# EasyEDA Pro project 轮足机器人主板&核心板.epro, board PCB7
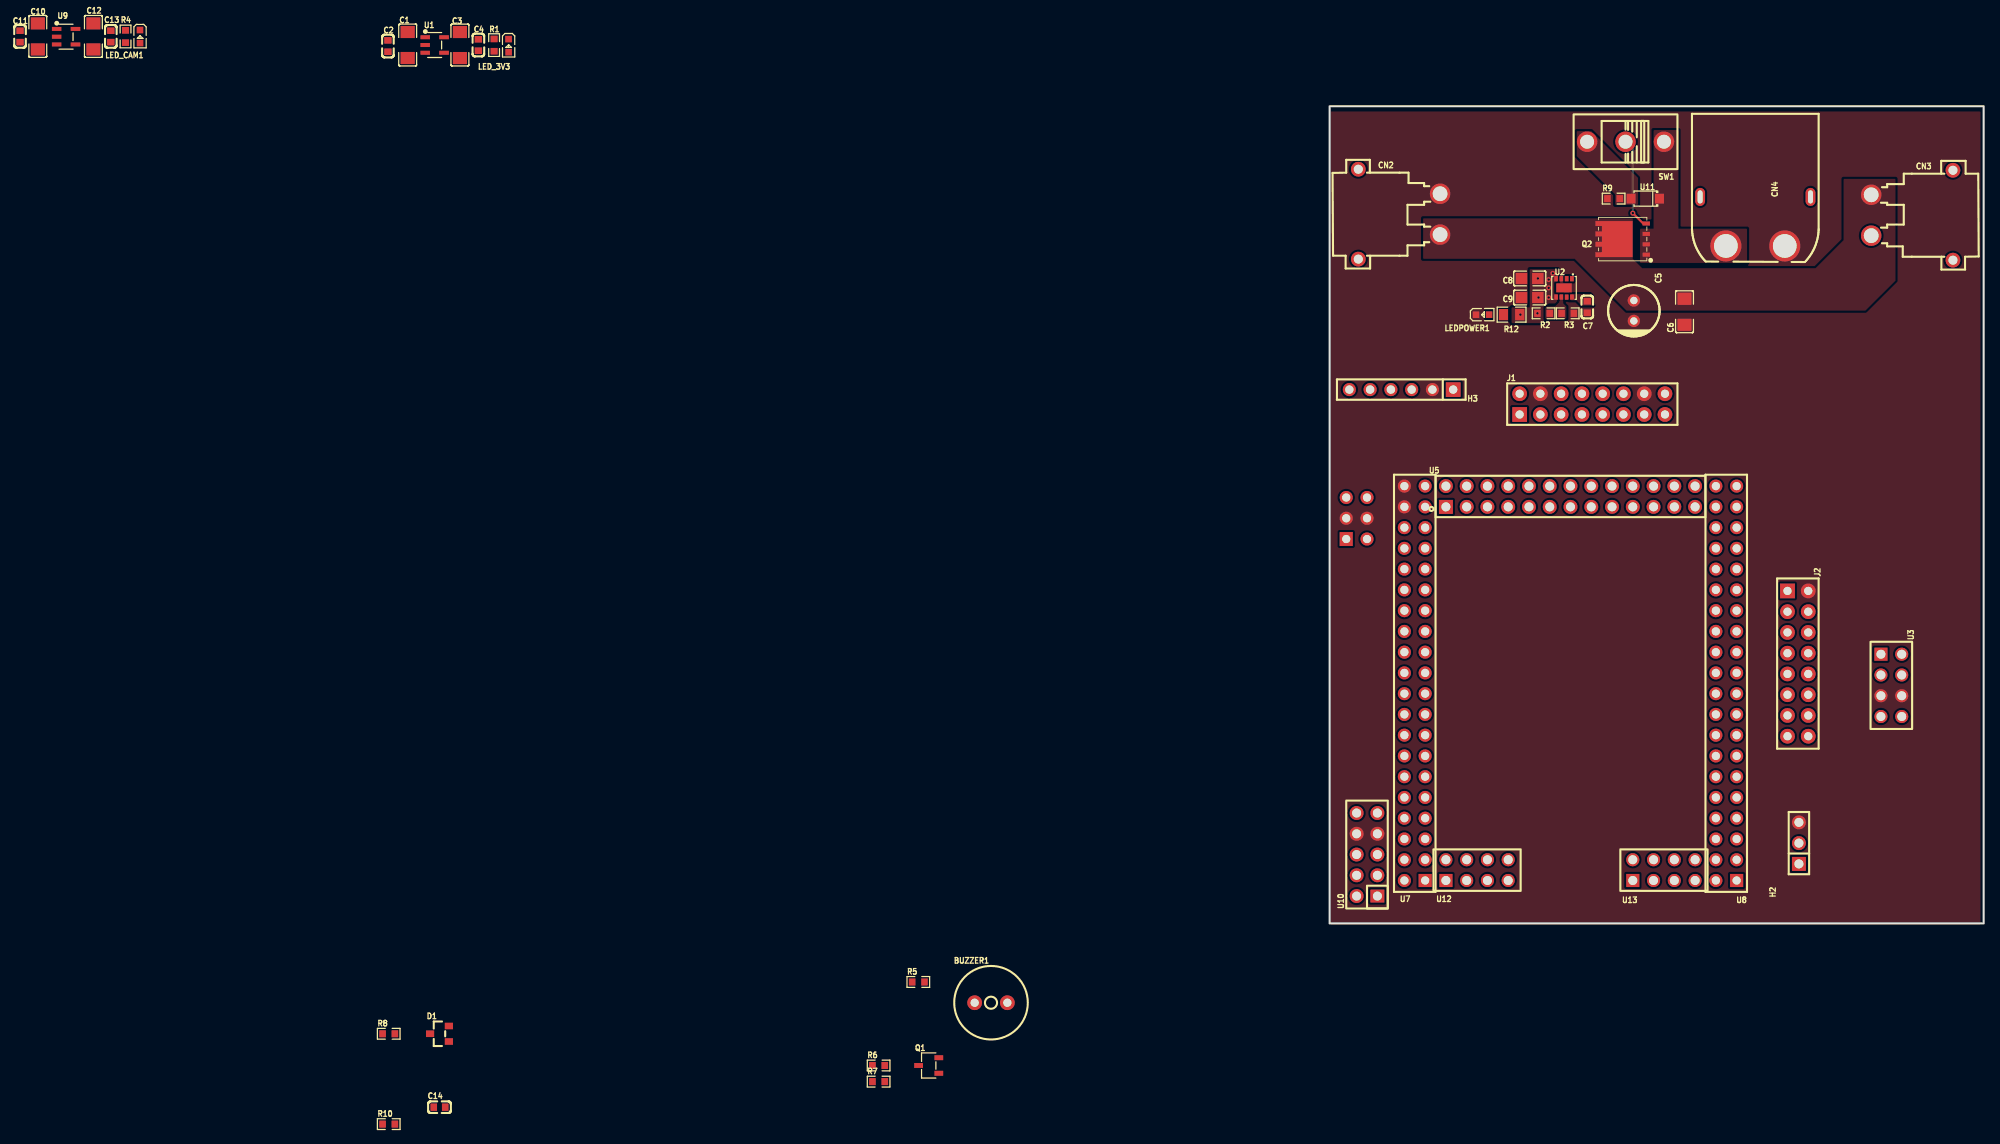
[diagram p9: board, top side]
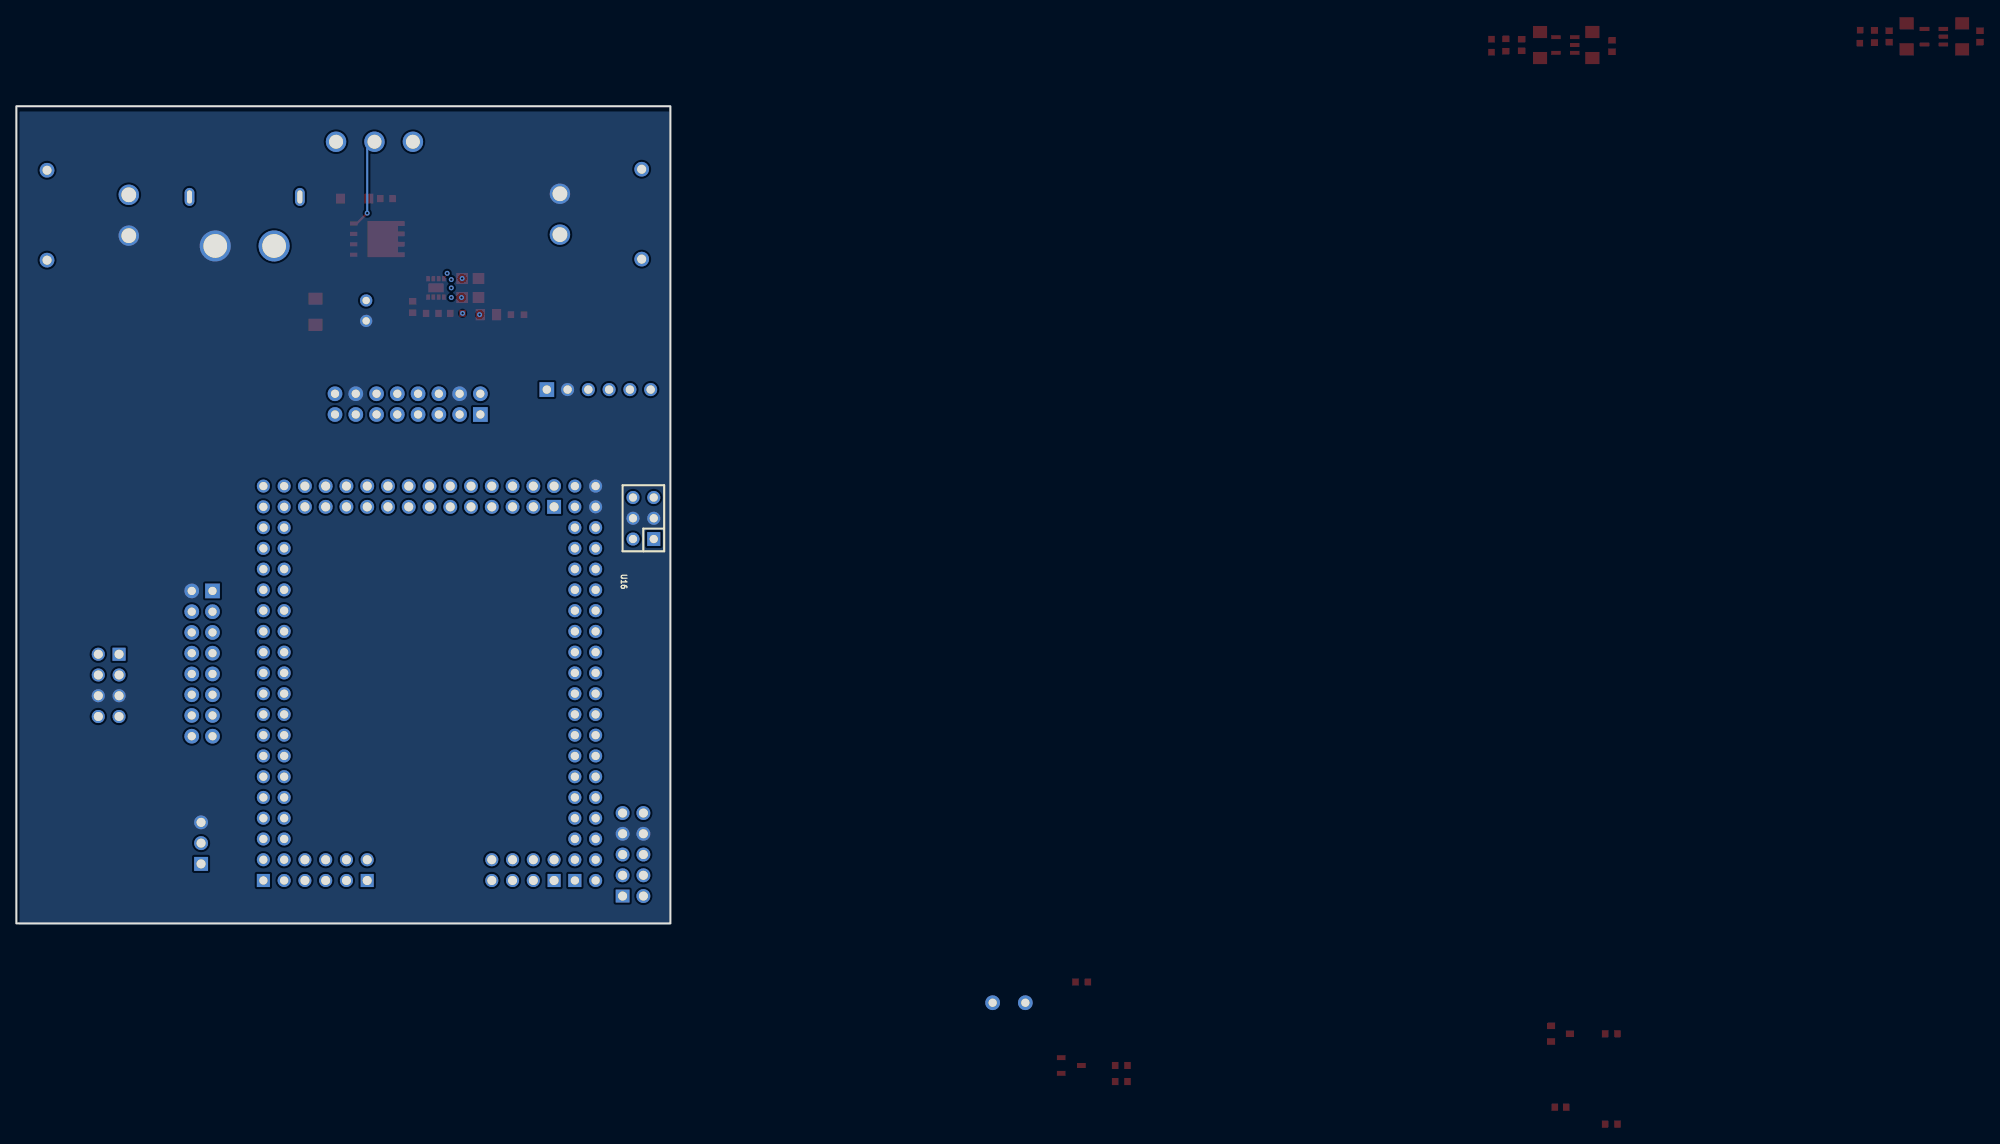
[diagram p10: board, bottom side, seen from below]

Outline 80 x 100 mm; copper layers: Top Layer, Inner1, Inner2, Bottom Layer. Coordinates in mm from the lower left corner of the outline.
Outline path: rectangle 0,100 80,0
Stack: Top Layer 0.035mm 外层铜厚1oz / Dielectric1 0.2104mm 7628 RC49% 8.6mil / Inner1 0.0152mm 内层铜厚 / Dielectric2 1.065mm 1.1mm H/HOZ Copper / Inner2 0.0152mm 内层铜厚 / Dielectric3 0.2104mm 7628 RC49% 8.6mil / Bottom Layer 0.035mm 外层铜厚1oz

## Design rules (mm)
template: 自定义配置
spacing copperThickness1oz (default): track to track 0.102, other pairs 0.152 to 0.3
spacing copperThickness2oz: track to track 0.203, other pairs 0.152 to 0.3
track width copperThickness1oz (default): min 0.127, default 0.254, max 2.54
track width copperThickness2oz: min 0.203, default 0.254, max 2.54
differential pair differentialPair (default): width min 0.127, default 0.254, max 2.54; gap min 0.152, default 0.152
via viaSize (default): diameter min 0.5, default 0.61, max 10; hole min 0.3, default 0.305, max 6.3
net GND uses 直接连接
net +5V uses 直接连接
net VCC3V3 uses 直接连接
net VIN_BAT uses 直接连接
net $1N3693 uses 直接连接
net DCIN uses 直接连接
net $1N3695 uses 直接连接
net $1N3706 uses 直接连接

## Placement (name value [footprint] x y rotation side)
BUZZER1  2.7kHz  [BUZ-TH_BD9.0-P4.00-D0.6-FD]  -41.42 -9.7 0 top
C1  10uF  [C1206]  -112.78 107.49 90 top
C2  100nF  [C0603]  -115.19 107.37 90 top
C3  10uF  [C1206]  -106.38 107.49 90 top
C4  100nF  [C0603]  -104.13 107.49 90 top
C5  150uF  [CAP-TH_BD6.3-P2.50-D0.5-FD]  37.21 74.98 270 top
C6  10uF  [C1206]  43.41 74.85 90 top
C7  3.3nF  [C0603]  31.52 75.43 90 top
C8  22uF  [C0805]  24.47 78.93 180 top
C9  22uF  [C0805]  24.47 76.59 180 top
C10  10uF  [C1206]  -158.02 108.54 90 top
C11  100nF  [C0603]  -160.19 108.54 90 top
C12  10uF  [C1206]  -151.22 108.54 90 top
C13  100nF  [C0603]  -149.08 108.54 90 top
C14  100nF  [C0603]  -108.88 -22.48 0 top
CN2  XT30PW-M30.G.Y  [CONN-TH_XT30PW-M]  8.51 86.79 270 top
CN3  XT30PW-M30.G.Y  [CONN-TH_XT30PW-M]  71.25 86.67 90 top
CN4  XT60PW-M  [CONN-TH_XT60PW-M]  52.07 85.9 270 top
D1  BAV99  [SOT-23_L2.9-W1.3-P1.90-LS2.4-BR]  -108.88 -13.5 0 top
H2  PZ254V-11-03P  [HDR-TH_3P-P2.54-V-M]  57.4 9.83 90 top
H3  PM254V-11-06-H85  [HDR-TH_6P-P2.54-V-F]  8.76 65.33 180 top
J1  2.54-2*8P母  [HDR-TH_16P-P2.54-V-F-R2-C8-S2.54]  32.13 63.55 0 top
J2  2.54-2*8P母  [HDR-TH_16P-P2.54-V-F-R2-C8-S2.54]  57.28 31.8 270 top
LED_3V3  -  [LED_0603]  -100.42 107.36 270 top
LED_CAM1  -  [LED_0603]  -145.51 108.48 270 top
LEDPOWER1  -  [LED_0603]  18.76 74.5 0 top
Q1  S8050  [SOT-23-3_L2.9-W1.6-P1.90-LS2.8-BR]  -49.04 -17.38 0 top
Q2  AGM60P100A  [TDSON-8_L5.9-W5.2-P1.27-BL]  36.96 83.74 90 top
R1  2.7k  [R0603]  -102.2 107.48 90 top
R2  523kΩ  [R0603]  26.17 74.66 180 top
R3  100kΩ  [R0603]  29.12 74.66 180 top
R4  2.7k  [R0603]  -147.29 108.54 90 top
R5  10Ω  [R0603]  -50.31 -7.16 0 top
R6  4.7kΩ  [R0603]  -55.17 -17.38 0 top
R7  10K  [R0603]  -55.17 -19.35 0 top
R8  200k  [R0603]  -115.09 -13.5 0 top
R9  10k  [R0603]  34.74 88.7 0 top
R10  22k  [R0603]  -115.09 -24.56 0 top
R12  4.7kΩ  [R0805]  22.26 74.5 180 top
SW1  SS-12D10L3  [SW-TH_SS-12D10L3]  36.2 95.66 180 top
U1  RT9013-33GB  [SOT-23-5_L3.0-W1.7-P0.95-LS2.8-BL]  -109.47 107.49 270 top
U2  TPS82130SILR  [USIP-8_L3.0-W2.8-P0.65-TL-EP]  28.67 77.77 270 top
U3  2541FV-2x4P  [HDR-TH_8P-P2.54-V-F-R2-C4-S2.54]  68.71 29.13 270 top
U5  PM254-2-13-Z-8.5  [HDR-TH_26P-P2.54-V-F-R2-C13-S2.54-1]  29.46 52.25 0 top
U7  PM254-2-20-Z-8.5  [HDR-TH_40P-P2.54-V-F-R2-C20-S2.54]  10.41 29.39 90 top
U8  PM254-2-20-Z-8.5  [HDR-TH_40P-P2.54-V-F-R2-C20-S2.54]  48.51 29.39 90 top
U9  RT9013-33GB  [SOT-23-5_L3.0-W1.7-P0.95-LS2.8-BL]  -154.56 108.51 270 top
U10  2541FV-2x5P  [HDR-TH_10P-P2.54-V-F-R2-C5-S2.54]  4.57 8.43 90 top
U11  BZT52C16  [SOD-123_L2.7-W1.6-LS3.8-RD]  38.61 88.7 180 top
U12  PM254-2-04-Z-8.5  [HDR-TH_8P-P2.54-V-F-R2-C4-S2.54]  18.03 6.53 0 top
U13  PM254-2-04-Z-8.5  [HDR-TH_8P-P2.54-V-F-R2-C4-S2.54]  40.89 6.53 0 top
U16  PM254-2-03-Z-8.5  [HDR-TH_6P-P2.54-V-F-R2-C3-S2.54]  3.3 49.58 90 bottom

## Footprints (pads in the part's own frame, mm; a bottom-side part is the same pattern mirrored in y, then rotated)
BUZ-TH_BD9.0-P4.00-D0.6-FD
  round 1.8 hole 1: 1(-2,0) 2(2,0)
C0603
  rect 0.8x0.9 smd: 1(-0.7,0) 2(0.7,0)
C0805
  rect 1.41x1.35 smd: 1(-1,0) 2(1,0)
C1206
  rect 1.485x1.728 smd: 1(-1.593,0) 2(1.593,0)
CAP-TH_BD6.3-P2.50-D0.5-FD
  round 1.5 hole 0.9: 1(-1.25,0) 2(1.25,0)
CONN-TH_XT30PW-M
  round 2.5 hole 1.8: 1(-2.5,5) 2(2.5,5)
  round 1.8 hole 1.1: 3(5.5,-5) 4(-5.5,-5)
CONN-TH_XT60PW-M
  round 3.8 hole 2.9: 1(3,-3.6) 2(3,3.6)
  oval 2.2x1.2 hole 1.6x0.6: 3(-3,6.75) 4(-3,-6.75)
HDR-TH_3P-P2.54-V-M
  rect 1.7x1.7 hole 1.1: 1(-2.54,0)
  round 1.7 hole 1.1: 2(0,0) 3(2.54,0)
HDR-TH_6P-P2.54-V-F
  rect 1.8x1.8 hole 1.02: 1(-6.35,0)
  round 1.6 hole 1.02: 2(-3.81,0) 3(-1.27,0) 4(1.27,0) 5(3.81,0) 6(6.35,0)
HDR-TH_6P-P2.54-V-F-R2-C3-S2.54
  rect 1.7x1.6 hole 1: 1(-2.54,-1.27)
  round 1.6 hole 1: 2(-2.54,1.27) 3(0,-1.27) 4(0,1.27) 5(2.54,-1.27) 6(2.54,1.27)
HDR-TH_8P-P2.54-V-F-R2-C4-S2.54
  rect 1.6x1.6 hole 1.1: 1(-3.81,-1.27)
  round 1.6 hole 1.1: 2(-3.81,1.27) 3(-1.27,-1.27) 4(-1.27,1.27) 5(1.27,-1.27) 6(1.27,1.27) 7(3.81,-1.27) 8(3.81,1.27)
HDR-TH_10P-P2.54-V-F-R2-C5-S2.54
  rect 1.575x1.7 hole 1.1: 1(-5.08,-1.27)
  round 1.7 hole 1.1: 2(-5.08,1.27) 3(-2.54,-1.27) 4(-2.54,1.27) 5(0,-1.27) 6(0,1.27) 7(2.54,-1.27) 8(2.54,1.27) 9(5.08,-1.27) 10(5.08,1.27)
HDR-TH_16P-P2.54-V-F-R2-C8-S2.54
  rect 1.8x1.8 hole 1: 1(-8.89,-1.27)
  round 1.8 hole 1: 2(-8.89,1.27) 3(-6.35,-1.27) 4(-6.35,1.27) 5(-3.81,-1.27) 6(-3.81,1.27) 7(-1.27,-1.27) 8(-1.27,1.27) 9(1.27,-1.27) 10(1.27,1.27) 11(3.81,-1.27) 12(3.81,1.27) 13(6.35,-1.27) 14(6.35,1.27) 15(8.89,-1.27) 16(8.89,1.27)
HDR-TH_26P-P2.54-V-F-R2-C13-S2.54-1
  rect 1.7x1.7 hole 1.1: 1(-15.24,-1.27)
  round 1.7 hole 1.1: 2(-15.24,1.27) 3(-12.7,-1.27) 4(-12.7,1.27) 5(-10.16,-1.27) 6(-10.16,1.27) 7(-7.62,-1.27) 8(-7.62,1.27) 9(-5.08,-1.27) 10(-5.08,1.27) 11(-2.54,-1.27) 12(-2.54,1.27) 13(0,-1.27) 14(0,1.27) 15(2.54,-1.27) 16(2.54,1.27) 17(5.08,-1.27) 18(5.08,1.27) 19(7.62,-1.27) 20(7.62,1.27) 21(10.16,-1.27) 22(10.16,1.27) 23(12.7,-1.27) 24(12.7,1.27) 25(15.24,-1.27) 26(15.24,1.27)
HDR-TH_40P-P2.54-V-F-R2-C20-S2.54
  rect 1.6x1.6 hole 1: 1(-24.13,-1.27)
  round 1.6 hole 1: 2(-24.13,1.27) 3(-21.59,-1.27) 4(-21.59,1.27) 5(-19.05,-1.27) 6(-19.05,1.27) 7(-16.51,-1.27) 8(-16.51,1.27) 9(-13.97,-1.27) 10(-13.97,1.27) 11(-11.43,-1.27) 12(-11.43,1.27) 13(-8.89,-1.27) 14(-8.89,1.27) 15(-6.35,-1.27) 16(-6.35,1.27) 17(-3.81,-1.27) 18(-3.81,1.27) 19(-1.27,-1.27) 20(-1.27,1.27) 21(1.27,-1.27) 22(1.27,1.27) 23(3.81,-1.27) 24(3.81,1.27) 25(6.35,-1.27) 26(6.35,1.27) 27(8.89,-1.27) 28(8.89,1.27) 29(11.43,-1.27) 30(11.43,1.27) 31(13.97,-1.27) 32(13.97,1.27) 33(16.51,-1.27) 34(16.51,1.27) 35(19.05,-1.27) 36(19.05,1.27) 37(21.59,-1.27) 38(21.59,1.27) 39(24.13,-1.27) 40(24.13,1.27)
LED_0603
  rect 0.8x0.8 smd: 1(-0.851,-0.01) 2(0.75,-0.005)
R0603
  rect 0.806x0.864 smd: 1(-0.753,0) 2(0.753,0)
R0805
  rect 1.133x1.377 smd: 1(-1,0) 2(1,0)
SOD-123_L2.7-W1.6-LS3.8-RD
  rect 1.1x1.2 smd: 1(-1.735,0) 2(1.735,0)
SOT-23-3_L2.9-W1.6-P1.90-LS2.8-BR
  rect 1.07x0.6 smd: 1(1.235,-0.95) 2(1.235,0.95) 3(-1.235,0)
SOT-23-5_L3.0-W1.7-P0.95-LS2.8-BL
  rect 0.49x1.157 smd: 1(-0.95,-1.153) 2(0,-1.153) 3(0.95,-1.153)
  rect 0.49x1.175 smd: 4(0.95,1.153) 5(-0.95,1.153)
SOT-23_L2.9-W1.3-P1.90-LS2.4-BR
  rect 1x0.8 smd: 1(1.15,-0.95) 2(1.15,0.95) 3(-1.15,0)
SW-TH_SS-12D10L3
  round 2.5 hole 1.7: 1(-4.7,0) 2(0,0) 3(4.7,0)
TDSON-8_L5.9-W5.2-P1.27-BL
  rect 0.5x0.9 smd: 1(-1.905,-1.775) 2(-0.635,-1.775) 3(0.635,-1.775) 4(1.905,-1.775)
  custom 4.41x4.55 smd: 5(0,1.775)
USIP-8_L3.0-W2.8-P0.65-TL-EP
  rect 0.65x0.45 smd: 1(-1.125,0.975) 2(-1.125,0.325) 3(-1.125,-0.325) 4(-1.125,-0.975) 5(1.125,-0.975) 6(1.125,-0.325) 7(1.125,0.325) 8(1.125,0.975)
  rect 1.1x1.9 smd: 9(0,0)

## Nets
As in the schematic.

Pads without a net: CN2 3 4; CN3 3 4; CN4 3 4; J1 10; U1 4; U2 7; U3 2; U9 4; U10 2

## Via types
v1: diameter 0.61, hole 0.305, Top Layer to Bottom Layer, 9 vias

## Routing (per net, layer and track width the routed paths; a pad name or vN(x,y) marks a point on that pad's centre or on a via; arc(x,y) is an arc through that point)
+5V:
  vias: v1(23.33,74.5) v1(25.42,74.66) v1(25.47,78.93) v1(25.55,76.59) v1(26.8,78.79) v1(26.8,77.78) v1(26.8,76.59) v1(27.3,79.55)
$1N3707: length 11.3
  Top Layer w0.254: v1(37.08,86.92) 38.35,85.65 Q2.4
  Bottom Layer w0.254: v1(37.08,86.92) 37.08,94.77 SW1.2

## Copper pours and planes (outline as drawn; the poured copper is in the pictures)
+5V on Top Layer: 27.94,78.41 27.94,80.06 24.47,80.06 24.47,73.52 26.17,73.52 26.17,75.25 26.8,75.87 27.69,75.87 27.94,76.12 27.94,77.09 27.49,77.09 27.49,78.41 27.49,78.41
+5V on Top Layer: 22.26,75.4 26.16,75.4 26.16,73.46 22.26,73.46
+5V on Inner1: -8.13,106.73 88.52,106.73 88.52,-7.44 -8.13,-7.44
GND on Top Layer: -4.32,103.68 84.33,103.68 84.33,-3.89 -4.32,-3.89
GND on Bottom Layer: -16,113.46 97.54,113.46 97.54,-16.21 -16,-16.21
GND on Inner2: -11.56,110.41 92.96,110.41 92.96,-12.52 -11.56,-12.52
VIN_BAT on Top Layer: 11.43,86.28 37.08,86.28 37.08,81.33 11.43,81.33
VIN_BAT on Top Layer: 29.85,81.46 36.96,81.46 38.23,80.19 59.44,80.19 62.86,83.62 62.86,91.11 69.22,91.11 69.22,78.66 65.53,74.98 36.32,74.98
DCIN on Top Layer: 39.62,97.08 42.67,97.08 42.67,84.63 39.62,84.63
DCIN on Top Layer: 51.05,80.82 37.97,80.82 37.97,85.01 51.05,85.01
$1N3693 on Top Layer: 29.34,77.01 31.85,77.01 32.13,76.73 32.13,75.74 32.26,75.62 30.81,75.62 30.17,76.25 29.34,76.25
$1N3695 on Top Layer: 28.96,74 28.96,75.49 28.58,75.87 28.58,77.05 28.07,77.05 28.07,76 27.56,75.49 26.56,75.49 26.39,75.32 26.39,74
$1N3706 on Top Layer: 37.72,87.94 34.92,87.94 34.92,89.2 30.23,93.9 30.23,96.95 32,96.95 37.72,91.24
